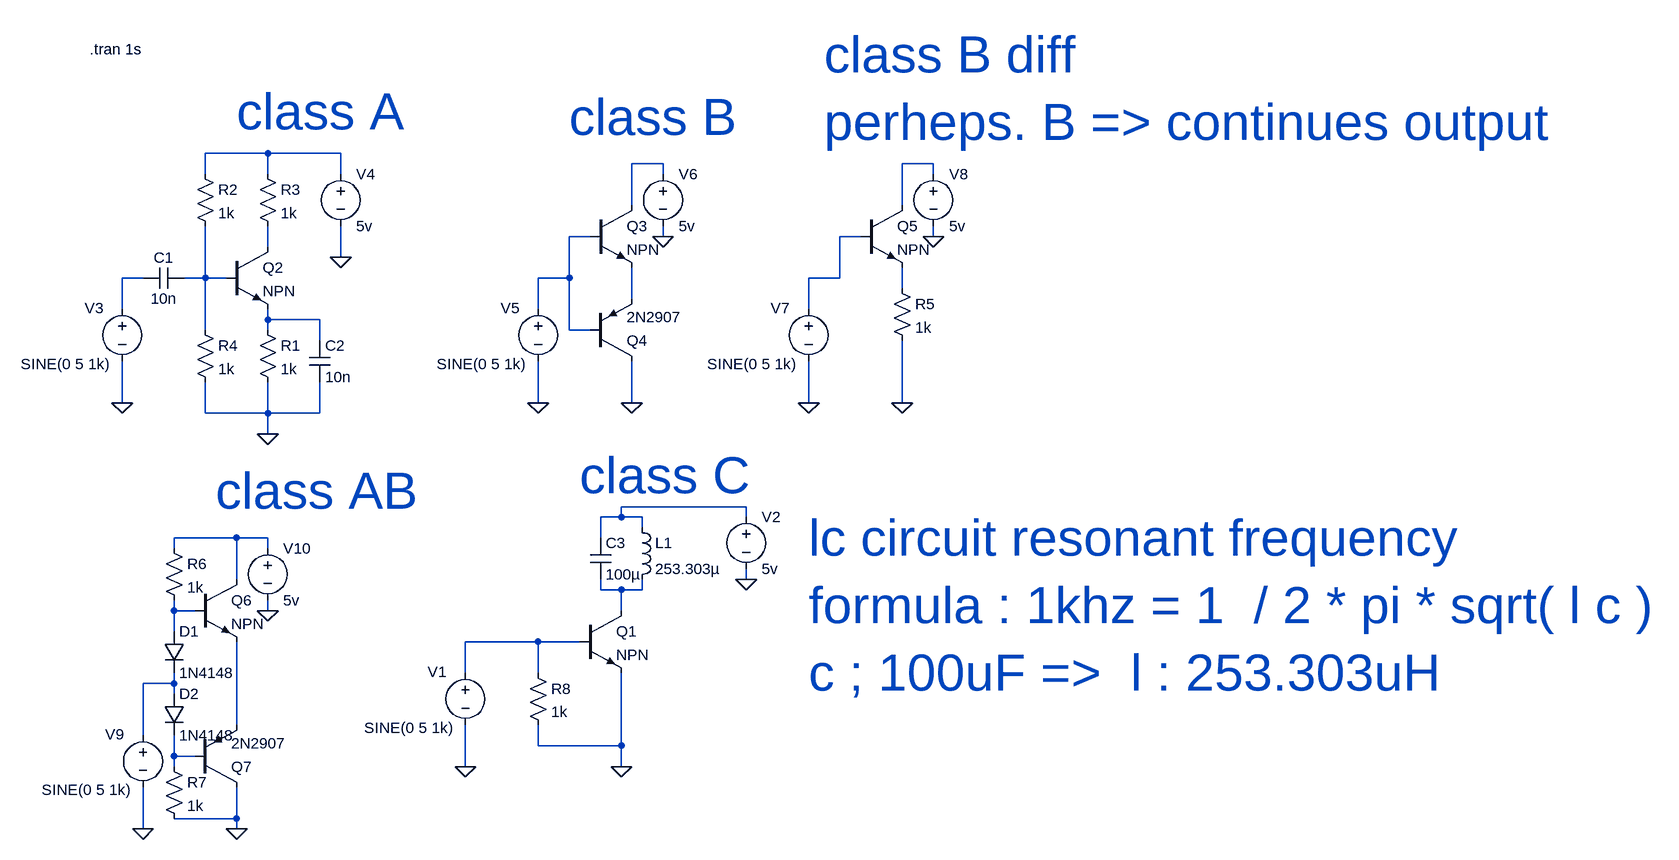
[diagram p0: schematic Amplifier Classes simulation.asc]
Amplifier Classes simulation.asc, the LTspice schematic file:
Version 4
SHEET 1 3360 1076
WIRE 1024 16 928 16
WIRE 1136 16 1024 16
WIRE 1632 32 1584 32
WIRE 2048 32 2000 32
WIRE 928 48 928 16
WIRE 1024 48 1024 16
WIRE 1136 48 1136 16
WIRE 1632 48 1632 32
WIRE 2048 48 2048 32
WIRE 1584 96 1584 32
WIRE 2000 96 2000 32
WIRE 1520 144 1488 144
WIRE 1632 144 1632 128
WIRE 1936 144 1904 144
WIRE 2048 144 2048 128
WIRE 1024 160 1024 128
WIRE 1136 176 1136 128
WIRE 832 208 800 208
WIRE 928 208 928 128
WIRE 928 208 896 208
WIRE 960 208 928 208
WIRE 1488 208 1488 144
WIRE 1488 208 1440 208
WIRE 1904 208 1904 144
WIRE 1904 208 1856 208
WIRE 2000 224 2000 192
WIRE 1584 240 1584 192
WIRE 800 256 800 208
WIRE 1440 256 1440 208
WIRE 1856 256 1856 208
WIRE 1024 272 1024 256
WIRE 1104 272 1024 272
WIRE 928 288 928 208
WIRE 1024 288 1024 272
WIRE 1488 288 1488 208
WIRE 1520 288 1488 288
WIRE 1104 304 1104 272
WIRE 800 400 800 336
WIRE 1440 400 1440 336
WIRE 1584 400 1584 336
WIRE 1856 400 1856 336
WIRE 2000 400 2000 304
WIRE 928 416 928 368
WIRE 1024 416 1024 368
WIRE 1024 416 928 416
WIRE 1104 416 1104 368
WIRE 1104 416 1024 416
WIRE 1024 448 1024 416
WIRE 1760 560 1568 560
WIRE 1568 576 1568 560
WIRE 1568 576 1536 576
WIRE 1600 576 1568 576
WIRE 1760 576 1760 560
WIRE 1600 592 1600 576
WIRE 976 608 880 608
WIRE 1024 608 976 608
WIRE 1536 608 1536 576
WIRE 880 624 880 608
WIRE 1024 624 1024 608
WIRE 976 672 976 608
WIRE 1760 672 1760 656
WIRE 1536 688 1536 672
WIRE 1568 688 1536 688
WIRE 1600 688 1600 672
WIRE 1600 688 1568 688
WIRE 880 720 880 704
WIRE 912 720 880 720
WIRE 1024 720 1024 704
WIRE 1568 720 1568 688
WIRE 880 752 880 720
WIRE 1440 768 1328 768
WIRE 1504 768 1440 768
WIRE 1328 816 1328 768
WIRE 1440 816 1440 768
WIRE 880 832 880 816
WIRE 880 832 832 832
WIRE 880 848 880 832
WIRE 976 896 976 768
WIRE 832 912 832 832
WIRE 1440 928 1440 896
WIRE 1568 928 1568 816
WIRE 1568 928 1440 928
WIRE 880 944 880 912
WIRE 912 944 880 944
WIRE 880 960 880 944
WIRE 1328 960 1328 896
WIRE 1568 960 1568 928
WIRE 976 1040 976 992
WIRE 976 1040 880 1040
WIRE 832 1056 832 992
WIRE 976 1056 976 1040
FLAG 1024 448 0
FLAG 800 400 0
FLAG 1136 176 0
FLAG 1440 400 0
FLAG 1632 144 0
FLAG 1584 400 0
FLAG 1856 400 0
FLAG 2048 144 0
FLAG 2000 400 0
FLAG 832 1056 0
FLAG 1024 720 0
FLAG 976 1056 0
FLAG 1328 960 0
FLAG 1760 672 0
FLAG 1568 960 0
SYMBOL npn 960 160 R0
SYMATTR InstName Q2
SYMBOL cap 896 192 R90
WINDOW 0 0 32 VBottom 2
WINDOW 3 32 32 VTop 2
SYMATTR InstName C1
SYMATTR Value 10n
SYMBOL res 1008 272 R0
SYMATTR InstName R1
SYMATTR Value 1k
SYMBOL res 912 32 R0
SYMATTR InstName R2
SYMATTR Value 1k
SYMBOL res 912 272 R0
SYMATTR InstName R4
SYMATTR Value 1k
SYMBOL res 1008 32 R0
SYMATTR InstName R3
SYMATTR Value 1k
SYMBOL cap 1088 304 R0
SYMATTR InstName C2
SYMATTR Value 10n
SYMBOL voltage 800 240 R0
WINDOW 0 -58 14 Left 2
WINDOW 3 -156 100 Left 2
WINDOW 123 0 0 Left 0
WINDOW 39 0 0 Left 0
SYMATTR InstName V3
SYMATTR Value SINE(0 5 1k)
SYMBOL voltage 1136 32 R0
SYMATTR InstName V4
SYMATTR Value 5v
SYMBOL npn 1520 96 R0
SYMATTR InstName Q3
SYMBOL pnp 1520 336 M180
SYMATTR InstName Q4
SYMATTR Value 2N2907
SYMBOL voltage 1440 240 R0
WINDOW 0 -58 14 Left 2
WINDOW 3 -156 100 Left 2
WINDOW 123 0 0 Left 0
WINDOW 39 0 0 Left 0
SYMATTR InstName V5
SYMATTR Value SINE(0 5 1k)
SYMBOL voltage 1632 32 R0
SYMATTR InstName V6
SYMATTR Value 5v
SYMBOL npn 1936 96 R0
SYMATTR InstName Q5
SYMBOL voltage 1856 240 R0
WINDOW 0 -58 14 Left 2
WINDOW 3 -156 100 Left 2
WINDOW 123 0 0 Left 0
WINDOW 39 0 0 Left 0
SYMATTR InstName V7
SYMATTR Value SINE(0 5 1k)
SYMBOL voltage 2048 32 R0
SYMATTR InstName V8
SYMATTR Value 5v
SYMBOL res 1984 208 R0
SYMATTR InstName R5
SYMATTR Value 1k
SYMBOL npn 912 672 R0
SYMATTR InstName Q6
SYMBOL pnp 912 992 M180
SYMATTR InstName Q7
SYMATTR Value 2N2907
SYMBOL voltage 832 896 R0
WINDOW 0 -58 14 Left 2
WINDOW 3 -156 100 Left 2
WINDOW 123 0 0 Left 0
WINDOW 39 0 0 Left 0
SYMATTR InstName V9
SYMATTR Value SINE(0 5 1k)
SYMBOL voltage 1024 608 R0
SYMATTR InstName V10
SYMATTR Value 5v
SYMBOL res 864 608 R0
SYMATTR InstName R6
SYMATTR Value 1k
SYMBOL diode 864 752 R0
SYMATTR InstName D1
SYMATTR Value 1N4148
SYMBOL diode 864 848 R0
SYMATTR InstName D2
SYMATTR Value 1N4148
SYMBOL res 864 944 R0
SYMATTR InstName R7
SYMATTR Value 1k
SYMBOL npn 1504 720 R0
SYMATTR InstName Q1
SYMBOL voltage 1328 800 R0
WINDOW 0 -58 14 Left 2
WINDOW 3 -156 100 Left 2
WINDOW 123 0 0 Left 0
WINDOW 39 0 0 Left 0
SYMATTR InstName V1
SYMATTR Value SINE(0 5 1k)
SYMBOL voltage 1760 560 R0
SYMATTR InstName V2
SYMATTR Value 5v
SYMBOL res 1424 800 R0
SYMATTR InstName R8
SYMATTR Value 1k
SYMBOL cap 1520 608 R0
SYMATTR InstName C3
SYMATTR Value 100µ
SYMBOL ind 1584 576 R0
SYMATTR InstName L1
SYMATTR Value 253.303µ
TEXT 750 -144 Left 2 !.tran 1s
TEXT 976 -48 Left 6 ;class A
TEXT 1488 -40 Left 6 ;class B
TEXT 1880 -136 Left 6 ;class B diff\nperheps. B => continues output
TEXT 944 536 Left 6 ;class AB
TEXT 1504 512 Left 6 ;class C
TEXT 1856 608 Left 6 ;lc circuit resonant frequency\nformula : 1khz = 1  / 2 * pi * sqrt( l c )\nc ; 100uF =>  l : 253.303uH

The netlist it stands for:
* Amplifier Classes simulation.asc
Q2 N006 N008 N011 0 NPN
C1 N008 N007 10n
R1 N011 0 1k
R2 N001 N008 1k
R4 N008 0 1k
R3 N001 N006 1k
C2 N011 0 10n
V3 N007 0 SINE(0 5 1k)
V4 N001 0 5v
Q3 N002 N004 N010 0 NPN
Q4 0 N004 N010 0 2N2907
V5 N004 0 SINE(0 5 1k)
V6 N002 0 5v
Q5 N003 N005 N009 0 NPN
V7 N005 0 SINE(0 5 1k)
V8 N003 0 5v
R5 N009 0 1k
Q6 N013 N015 N018 0 NPN
Q7 0 N019 N018 0 2N2907
V9 N017 0 SINE(0 5 1k)
V10 N013 0 5v
R6 N013 N015 1k
D1 N015 N017 1N4148
D2 N017 N019 1N4148
R7 N019 0 1k
Q1 N014 N016 0 0 NPN
V1 N016 0 SINE(0 5 1k)
V2 N012 0 5v
R8 N016 0 1k
C3 N012 N014 100µ
L1 N012 N014 253.303µ
.model D D
.lib standard.dio
.model NPN NPN
.model PNP PNP
.lib standard.bjt
.tran 1s
* class A
* class B
* class B diff
* perheps. B => continues output
* class AB
* class C
* lc circuit resonant frequency
* formula : 1khz = 1  / 2 * pi * sqrt( l c )
* c ; 100uF =>  l : 253.303uH
.backanno
.end